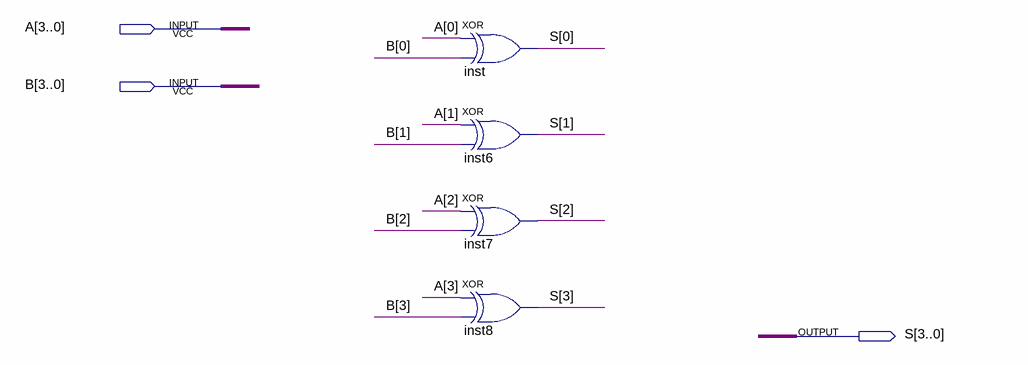
[diagram p0: schematic sheet]
// Quartus schematic ALU_XOR.bdf as structural Verilog: 4 symbols, 3 pins
module ALU_XOR (
  input  [3:0] A,
  input  [3:0] B,
  output [3:0] S
);

  xor inst (S[0], A[0], B[0]);
  xor inst6 (S[1], A[1], B[1]);
  xor inst7 (S[2], A[2], B[2]);
  xor inst8 (S[3], A[3], B[3]);
endmodule
